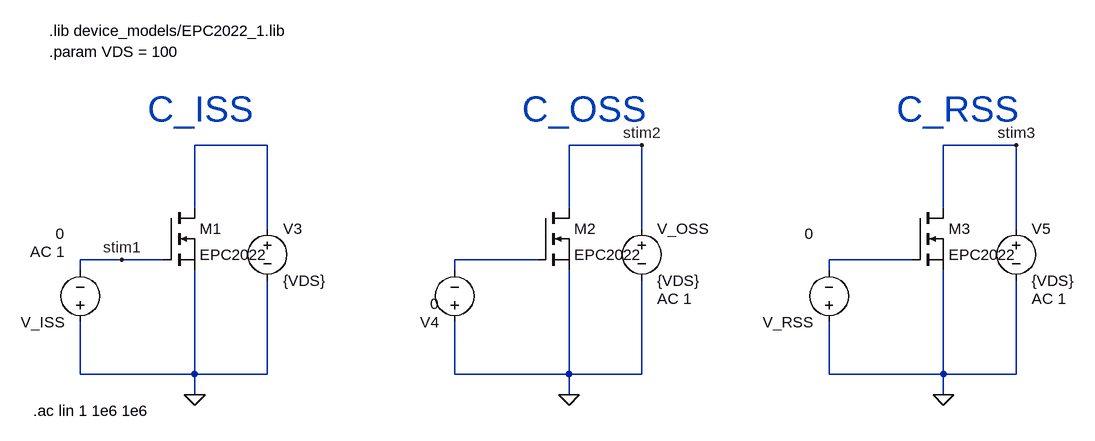
[diagram p0: schematic cv_testbed.asc]
cv_testbed.asc, the LTspice schematic file:
Version 4
SHEET 1 4248 2020
WIRE 496 -672 384 -672
WIRE 1072 -672 960 -672
WIRE 1648 -672 1536 -672
WIRE 384 -576 384 -672
WIRE 960 -576 960 -672
WIRE 1536 -576 1536 -672
WIRE 496 -544 496 -672
WIRE 1072 -544 1072 -672
WIRE 1648 -544 1648 -672
WIRE 272 -496 208 -496
WIRE 336 -496 272 -496
WIRE 912 -496 784 -496
WIRE 1488 -496 1360 -496
WIRE 208 -480 208 -496
WIRE 784 -480 784 -496
WIRE 1360 -480 1360 -496
WIRE 208 -320 208 -400
WIRE 384 -320 384 -480
WIRE 384 -320 208 -320
WIRE 496 -320 496 -464
WIRE 496 -320 384 -320
WIRE 784 -320 784 -400
WIRE 960 -320 960 -480
WIRE 960 -320 784 -320
WIRE 1072 -320 1072 -464
WIRE 1072 -320 960 -320
WIRE 1360 -320 1360 -400
WIRE 1536 -320 1536 -480
WIRE 1536 -320 1360 -320
WIRE 1648 -320 1648 -464
WIRE 1648 -320 1536 -320
WIRE 384 -288 384 -320
WIRE 960 -288 960 -320
WIRE 1536 -288 1536 -320
FLAG 384 -288 0
FLAG 272 -496 stim1
FLAG 1072 -672 stim2
FLAG 1648 -672 stim3
FLAG 960 -288 0
FLAG 1536 -288 0
SYMBOL voltage 496 -560 R0
WINDOW 123 0 0 Left 0
WINDOW 39 0 0 Left 0
SYMATTR InstName V3
SYMATTR Value {VDS}
SYMBOL voltage 208 -384 R180
WINDOW 123 24 124 Left 2
WINDOW 39 0 0 Left 2
WINDOW 3 24 152 Left 2
SYMATTR Value2 AC 1
SYMATTR Value 0
SYMATTR InstName V_ISS
SYMBOL voltage 1072 -560 R0
WINDOW 123 24 124 Left 2
WINDOW 39 0 0 Left 2
SYMATTR Value2 AC 1
SYMATTR InstName V_OSS
SYMATTR Value {VDS}
SYMBOL voltage 784 -384 R180
WINDOW 123 24 124 Left 2
WINDOW 39 0 0 Left 2
WINDOW 3 24 44 Left 2
SYMATTR Value 0
SYMATTR InstName V4
SYMBOL voltage 1648 -560 R0
WINDOW 123 24 124 Left 2
WINDOW 39 0 0 Left 2
SYMATTR Value2 AC 1
SYMATTR InstName V5
SYMATTR Value {VDS}
SYMBOL voltage 1360 -384 R180
WINDOW 123 24 124 Left 2
WINDOW 39 0 0 Left 2
WINDOW 3 24 152 Left 2
SYMATTR Value 0
SYMATTR InstName V_RSS
SYMBOL nmos 336 -576 R0
SYMATTR InstName M1
SYMATTR Value EPC2022
SYMATTR Prefix X
SYMBOL nmos 912 -576 R0
SYMATTR InstName M2
SYMATTR Value EPC2022
SYMATTR Prefix X
SYMBOL nmos 1488 -576 R0
SYMATTR InstName M3
SYMATTR Value EPC2022
SYMATTR Prefix X
TEXT 136 -264 Left 2 !.ac lin 1 1e6 1e6
TEXT 312 -728 Left 5 ;C_ISS
TEXT 160 -816 Left 2 !.param VDS = 100
TEXT 888 -728 Left 5 ;C_OSS
TEXT 1464 -728 Left 5 ;C_RSS
TEXT 160 -848 Left 2 !.lib device_models/EPC2022_1.lib

The netlist it stands for:
* cv_testbed.asc
V3 N001 0 {VDS}
V_ISS 0 stim1 0 AC 1
V_OSS stim2 0 {VDS} AC 1
V4 0 N002 0
V5 stim3 0 {VDS} AC 1
V_RSS 0 N003 0
XM1 N001 stim1 0 EPC2022  ; pins D G S
XM2 stim2 N002 0 EPC2022  ; pins D G S
XM3 stim3 N003 0 EPC2022  ; pins D G S
.ac lin 1 1e6 1e6
* C_ISS
.param VDS = 100
* C_OSS
* C_RSS
.lib device_models/EPC2022_1.lib
.backanno
.end